# EAGLE schematic sdcard (EAGLE 6.5.0)
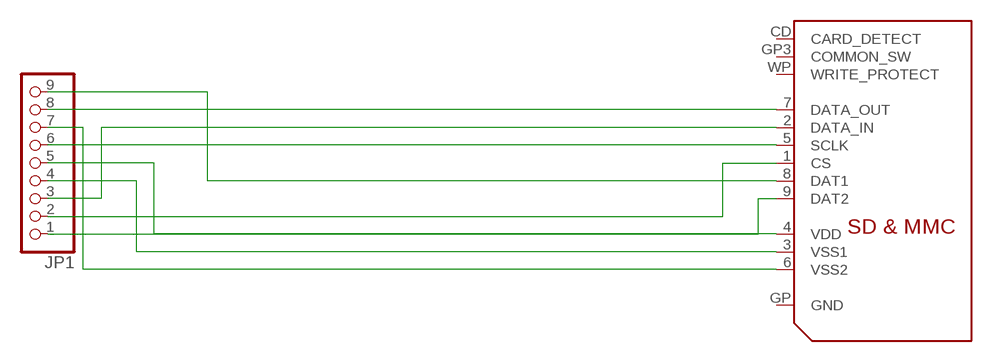
[diagram p0: schematic, sheet 1]

## Parts
JP1  PINHD-1X9  [1X09]
U$1  SDMMC06132  [06132]

## Nets
N$1: JP1.2 U$1.1(CS)
N$2: JP1.1 U$1.9(DAT2)
N$3: JP1.3 U$1.2(DATA_IN)
N$4: JP1.6 U$1.5(SCLK)
N$5: JP1.8 U$1.7(DATA_OUT)
N$6: JP1.9 U$1.8(DAT1)
VDD: JP1.5 U$1.4(VDD)
VSS1: JP1.4 U$1.3(VSS1)
VSS2: JP1.7 U$1.6(VSS2)
Unconnected: U$1.CD(CARD_DETECT) U$1.GP3(COMMON_SW) U$1.GP(GND) U$1.WP(WRITE_PROTECT)

## Library data of the parts
JP1 = pinhead:PINHD-1X9: PIN HEADER
U$1 = adafruit:SDMMC: SD MMC Card holder 4UCON part #06132 - easy to solder